# Altium schematic sheet USB.SchDoc
size A
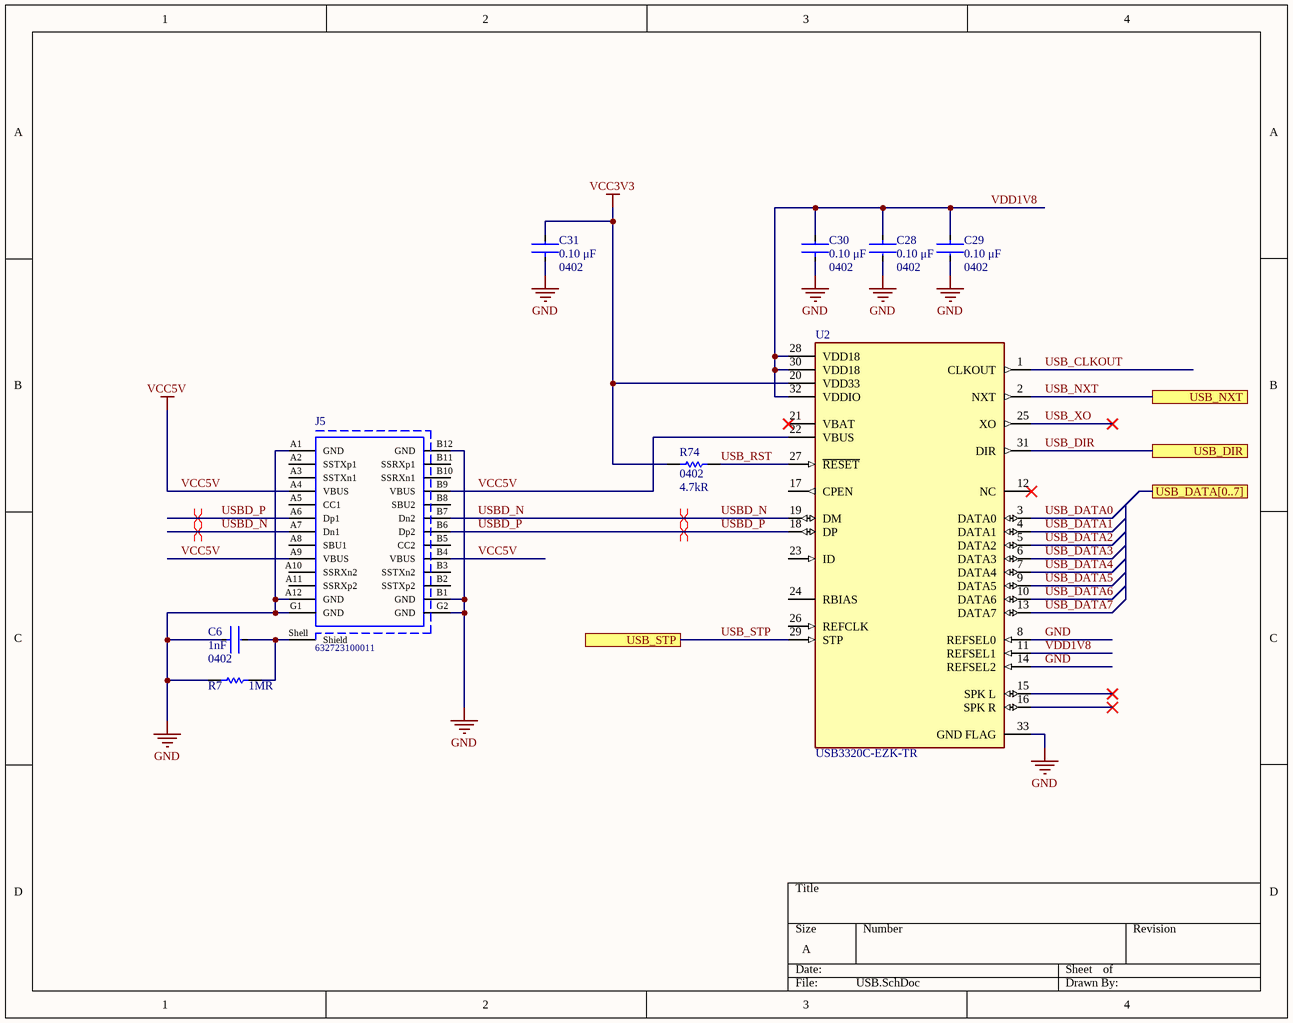
[diagram p0: USB.SchDoc]

## Parts
C6  Case/Package: 0402  Capacitance: 1nF  [FP-GRM155-0_05-IPC_B]  (hidden comment: GRM1555C1H102JA01D)
C28  value 0.10 μF  Case/Package: 0402  [FP-C0402-BB-MFG]  (hidden comment: C0402C104K8PACTU)
C29  value 0.10 μF  Case/Package: 0402  [FP-C0402-BB-MFG]  (hidden comment: C0402C104K8PACTU)
C30  value 0.10 μF  Case/Package: 0402  [FP-C0402-BB-MFG]  (hidden comment: C0402C104K8PACTU)
C31  value 0.10 μF  Case/Package: 0402  [FP-C0402-BB-MFG]  (hidden comment: C0402C104K8PACTU)
J5  632723100011  [632723100011]
R7  value 1MR  [RESC1005X40X25LL05T05]  (hidden comment: ERJ-2RKF1004X)
R74  value 4.7kR  PackageReference: 0402  [RESC1005X40X25LL05T05]  (hidden comment: ERJ-2RKF4701X)
U2  USB3320C-EZK-TR  [FP-32QFN-3304-5X5B-MFG]

## Ports
USB_DATA[0..7], USB_DIR, USB_NXT, USB_STP

## Nets
GND: C6.1 C28.2 C29.2 C30.1 C31.1 J5.A1(GND) J5.A12(GND) J5.B1(GND) J5.B12(GND) J5.G1(GND) J5.G2(GND) R7.1 U2.8(REFSEL0) U2.14(REFSEL2) U2.33(GND_FLAG)
VCC3V3: C31.2 R74.2 U2.20(VDD33)
VCC5V: J5.A4(VBUS) J5.A9(VBUS) J5.B4(VBUS) J5.B9(VBUS) U2.22(VBUS)
USB_CLKOUT: U2.1(CLKOUT)
USB_DATA0: U2.3(DATA0)
USB_DATA1: U2.4(DATA1)
USB_DATA2: U2.5(DATA2)
USB_DATA3: U2.6(DATA3)
USB_DATA4: U2.7(DATA4)
USB_DATA5: U2.9(DATA5)
USB_DATA6: U2.10(DATA6)
USB_DATA7: U2.13(DATA7)
USB_DIR: U2.31(DIR) ; port USB_DIR
USB_NXT: U2.2(NXT) ; port USB_NXT
USB_RST: R74.1 U2.27(~{RESET})
USB_STP: U2.29(STP) ; port USB_STP
USB_XO: U2.25(XO)
USBD_N: J5.A7(Dn1) J5.B7(Dn2) U2.19(DM)
USBD_P: J5.A6(Dp1) J5.B6(Dp2) U2.18(DP)
VDD1V8: C28.1 C29.1 C30.2 U2.11(REFSEL1) U2.28(VDD18) U2.30(VDD18) U2.32(VDDIO)
NetC6_2: C6.2 J5.Shell(Shield) R7.2

Not connected (* = marked no-connect by the designer): J5 A2(SSTXp1) A3(SSTXn1) A5(CC1) A8(SBU1) A10(SSRXn2) A11(SSRXp2) B2(SSTXp2) B3(SSTXn2) B5(CC2) B8(SBU2) B10(SSRXn1) B11(SSRXp1); U2 12(NC)* 15(SPK_L)* 16(SPK_R)* 17(CPEN) 21(VBAT)* 23(ID) 24(RBIAS) 26(REFCLK)

## Layout directives
differential pair: USBD_N, USBD_P

## Library data of the parts
C6 = CMP-2008-04254-2: Chip Multilayer Ceramic Capacitors for General Purpose, 0402, 1000pF, C0G, 30ppm/°C, 5%, 50V; Manufacturer: Murata; Insulation Resistance: 10GR; Value: 1nF; Packaging: Tape and Reel; Lead Free: Lead Free; Tolerance: 5%; Temperature Coefficient: 30ppm/°C; Thickness: 0.022inch; Termination: SMD/SMT; Max Operating Temperature: 125°C; Height: 0.5mm; Package Quantity: 1; Radiation Hardening: No; Material: Ceramic; Case Code (Metric): 1005; Number of Pins: 2; Voltage Rating: 50V; Mount: Surface Mount; Voltage: 50V; Min Operating Temperature: -55°C; Dielectric Material: Ceramic; Width: 0.5mm; Depth: 0.5mm; Case Code (Imperial): 0402; REACH SVHC: No SVHC; Dielectric: C0G; Voltage Rating (DC): 50V; Length: 1mm; Supplier 1: Arrow Electronics; Supplier Part Number 1: GRM1555C1H102JA01D; Manufacturer Part Number: GRM1555C1H102JA01D; RoHS: Yes; Category: Ceramic Capacitors; Stock 1: 3710000; Pricing 1: 10000=0.0068, 30000=0.0067, 50000=0.0066, 100000=0.0063 (USD); Mounting Technology: Surface Mount; Pins: 2; Series: GRM; Construction: Flat; Size: 0.5mm; RoHS Compliant: Yes; Reach SVHC Compliant: No
C28-C31 = CMP-2008-02046-2: CAP CER 0.1UF 10V X5R 0402; Manufacturer: Kemet; Material: Ceramic; Temperature Coefficient: 15%; Tolerance: 0.1; Dissipation Factor: 5%; Package: C0402-BB; Temperature: -55°C to +125°C; ComponentLink2Description: Datasheet; Capacitance: 0.10 μF; Temperature Characteristic: X5R; Device Class L1: Passive Components; Height: 0.55mm; Lead Free: Yes; ComponentLink2URL: https://content.kemet.com/datasheets/KEM_C1002_X7R_SMD.pdf; Device Class L2: Capacitors; Temperature Range Low: -55°C; Temperature Range High: +125°C; RoHS: TRUE; Octopart: https://octopart.com/c0402c104k8pactu-kemet-140039; Automotive: No; Mouser Description: Capacitor 100 nF 10 VDC 0402; Category: Cap; Voltage Rating: 10 V; Digikey Description: CAP CER 0.1UF 10V X5R 0402; Ipc Land Pattern Name: CAPC10050X50; Device Class L3: Ceramic Capacitors; Manufacturer Part Number: C0402C104K8PACTU; Supplier 1: Arrow Electronics; Supplier Part Number 1: C0402C104K8PACTU; Stock 1: 669298; Pricing 1: 1=0.0497, 10=0.0165, 25=0.0164, 100=0.0066, 250=0.0065, 1000=0.0064, 3000=0.0063, 15000=0.0062, 30000=0.0059, 75000=0.0057 (USD); Mounting Technology: Surface Mount,PCB; Pins: 2; Case Code (Metric): 1005; Case Code (Imperial): 0402; Dielectric Material: Ceramic; Min Operating Temperature: -55°C; Max Operating Temperature: 85°C; Packaging: Tape and Reel; Dielectric: X5R; Series: SMD Comm X5R; Voltage: 10V; Voltage Rating (DC): 10V; Package Quantity: 10000; Termination: SMD/SMT; Construction: Flat; Length: 1mm; Width: 0.5mm; Depth: 0.5mm; Lead Pitch: 0.3mm; Radiation Hardening: No; RoHS Compliant: Yes; Reach SVHC Compliant: No
J5 = CMP-1502-03213-1: USB 3.1 Type C Receptacle WR-COM, Horizontal, SMT / THT; Manufacturer: Wurth Elektronik; Working Voltage: 20VDC; Rated Current: 5A; Contact Resistance: 30mOhm; Operating Temperature: -40to105degC; Publisher: WurthElektronik; Gender: Receptacle; Part Number: 632723100011; Mounting Technology: SMT/THT; Datasheet URL: https://katalog.we-online.de/em/datasheet/632723x00011%282%29.pdf; Connector Type: USB3.1TypeC; Manufacturer URL: http://www.we-online.de; Orientation: Horizontal; Package Reference: 632723100011; Packaging: TapeandReel
R7 = CMP-2002-00609-3: Chip Resistor, 1 MOhm, +/- 1%, 100 mW, -55 to 155 degC, 0402 (1005 Metric), RoHS, Tape and Reel; Manufacturer: Basic Passives; Voltage Rating: 50 V; Case\/Package: 0402; Resistance: 1 MOhm; Power Rating: 100 mW; Temperature Coefficient: 100ppm/°C; Max Power Dissipation: 100mW; Voltage Rating (DC): 50V; Pins: 2; Max Operating Temperature: 155 degC; ComponentLink2URL: http://industrial.panasonic.com/cdbs/www-data/pdf/RDA0000/AOA0000C86.pdf; Weight: 2.8E-05oz; ComponentLink1URL: http://www.panasonic.com/; Radiation Hardening: No; Height: 0.35 mm; Case Code (Imperial): 0402; ComponentLink2Description: Datasheet; Mount: Surface Mount; ComponentLink1Description: Manufacturer URL; REACH SVHC: Yes; PartNumber: ERJ-2RKF1004X; Length: 1 mm; Min Operating Temperature: -55 degC; Width: 0.5 mm; Package Quantity: 10000; Tolerance: 1%; PackageDescription: 2-Pin Surface Mount Device, Body 1 x 0.5 mm; RoHSCompliant: true; DatasheetVersion: 04/2015; PackageReference: 0402; Mounting Technology: Surface Mount; Case Code (Metric): 1005; Packaging: Tape and Reel; Supplier 1: Arrow Electronics; Supplier Part Number 1: ERJ-2RKF1004X; Manufacturer Part Number: ERJ-2RKF1004X; RoHS: Yes; Category: Chip SMD Resistors; Stock 1: 960000; Pricing 1: 10000=0.0047, 50000=0.0041, 100000=0.0038 (USD); Case/Package: 0402; Contact Plating: Tin; Number of Terminations: 2; Series: ERJ; Features: Automotive AEC-Q200; Construction: Rectangular; Termination: SMD/SMT; Resistor Type: Thick Film; Resistance Tolerance: 1%; Technology: THICK FILM; Working Voltage: 50V; Depth: 0.5mm; RoHS Compliant: Yes; Lead Free: Lead Free; Military Standard: Not; Reach SVHC Compliant: Yes
R74 = CMP-2002-01154-4: Chip Resistor, 4.7 KOhm, +/- 1%, 0.1 W, -55 to 155 degC, 0402 (1005 Metric), RoHS, Tape and Reel; Manufacturer: Panasonic; Voltage Rating: 50 V; Power Rating: 100 mW; Temperature Coefficient: 100ppm/°C; Voltage Rating (DC): 50V; Height: 0.35 mm; Mounting Technology: Surface Mount; REACH SVHC: Yes; Resistance: 4.7 KOhm; Max Operating Temperature: 155 degC; ComponentLink1Description: Manufacturer URL; ComponentLink2Description: Datasheet; Pins: 2; Tolerance: 1%; Case Code (Imperial): 0402; Length: 1 mm; PackageDescription: 2-Pin Surface Mount Device, Body 1 x 0.5 mm; PartNumber: ERJ-2RKF4701X; RoHSCompliant: true; Package Quantity: 1; Radiation Hardening: No; DatasheetVersion: 04/2015; Width: 0.5 mm; Case Code (Metric): 1005; Case\/Package: 0402; Mount: Surface Mount; ComponentLink1URL: http://www.panasonic.com/; Min Operating Temperature: -55 degC; Packaging: Cut Tape; ComponentLink2URL: http://industrial.panasonic.com/cdbs/www-data/pdf/RDA0000/AOA0000C86.pdf; Supplier 1: Arrow Electronics; Supplier Part Number 1: ERJ-2RKF4701X; Manufacturer Part Number: ERJ-2RKF4701X; RoHS: Yes; Category: Chip SMD Resistors; Stock 1: 1642092; Pricing 1: 10000=0.003, 100000=0.0029 (USD); Weight: 0.000388oz; Termination: SMD/SMT; Series: ERJ-2Rx; Technology: THICK FILM; RoHS Compliant: Yes; Lead Free: Lead Free
U2 = CMP-0186-00336-2: IC TRANSCEIVER HALF 1/1 32QFN; Manufacturer: Microchip; Min Supply Voltage: 1.6V; Usb Standard: USB 2.0; Max Supply Voltage: 5.5V; Nominal Supply Current: 0.7-29400uA; Number Of Ports: 1; Interface: UART,USB; Standoff Height: 0mm; Data Rate: 12Mbps; ESD Protection: Yes; Operating Supply Current: 18uA; Frequency: 60MHz; Simplex/Duplex: Half Duplex; Receiver Hysteresis: 50mV; Digikey Description: IC TRANSCEIVER HALF 1/1 32QFN; Category: IC; Mouser Description: Microchip USB3320C-EZK-TR, USB Transceiver, USB 2.0, 1.8 V, 3.3 V, 32-Pin QFN; Ipc Land Pattern Name: QFN50P500X500X85-32; ComponentLink2Description: Datasheet; Device Class L2: Interface ICs; Temperature Range Low: -40°C; Ambient Temperature Range Low: -40°C; ComponentLink2URL: http://ww1.microchip.com/downloads/en/DeviceDoc/00001792E.pdf; Device Class L3: USB Interface ICs; Lead Free: Yes; RoHS: TRUE; Height: 1mm; Temperature Range High: +85°C; Octopart: https://octopart.com/usb3320c-ezk-tr-microchip-24995468; Device Class L1: Integrated Circuits (ICs); Automotive: No; Temperature: -40°C to +85°C; Ambient Temperature Range High: +85°C; Package: 32QFN-3304-5X5B; Manufacturer Part Number: USB3320C-EZK-TR; Supplier 1: Mouser; Supplier Part Number 1: 886-USB3320C-EZK-TR; Stock 1: 146343; Pricing 1: 1=2.17, 10=2.17, 50=1.92, 100=1.92, 1000=1.92, 10000=1.92 (USD); Case/Package: QFN; Pins: 32; Weight: 0.006653oz; Min Operating Temperature: -40°C; Max Operating Temperature: 85°C; Packaging: Tape and Reel; Number of Transceivers: 1; Operating Supply Voltage: 5.5V; Package Quantity: 4000; Series: flexPWR™; Length: 5.1mm; Width: 5.1mm; Radiation Hardening: No; RoHS Compliant: Yes; ComponentLink1URL: https://datasheet.ciiva.com/29718/3320-29718762.pdf?src-supplier=Digi-Key; ComponentLink1Description: https://datasheet.ciiva.com/29718/3320-29718762.pdf?src-supplier=Digi-Key; ComponentLink3URL: https://datasheet.ciiva.com/29718/filehandler-aspxddocname-en562261-29718763.pdf?src-supplier=Digi-Key; ComponentLink3Description: https://datasheet.ciiva.com/29718/filehandler-aspxddocname-en562261-29718763.pdf?src-supplier=Digi-Key; ComponentLink4URL: https://datasheet.ciiva.com/6635/filehandler-aspxddocname-en562261-6635128.pdf?src-supplier=Digi-Key; ComponentLink4Description: https://datasheet.ciiva.com/6635/filehandler-aspxddocname-en562261-6635128.pdf?src-supplier=Digi-Key